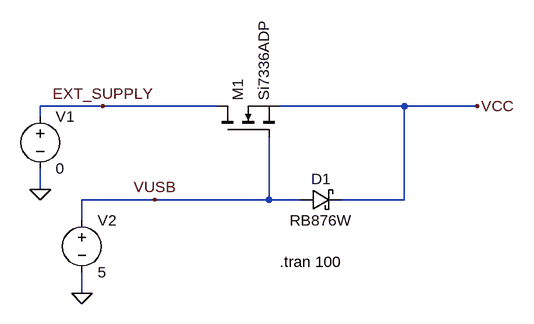
[diagram p0: schematic power_supply_selection.asc]
power_supply_selection.asc, the LTspice schematic file:
Version 4
SHEET 1 880 680
WIRE 64 288 -32 288
WIRE 240 288 64 288
WIRE 528 288 336 288
WIRE 640 288 528 288
WIRE -32 304 -32 288
WIRE -32 416 -32 384
WIRE 144 432 32 432
WIRE 320 432 320 336
WIRE 320 432 144 432
WIRE 368 432 320 432
WIRE 528 432 528 288
WIRE 528 432 432 432
WIRE 32 464 32 432
WIRE 32 576 32 544
FLAG 640 288 VCC
FLAG -32 416 0
FLAG 32 576 0
FLAG 64 288 EXT_SUPPLY
FLAG 144 432 VUSB
SYMBOL nmos 240 336 R270
SYMATTR InstName M1
SYMATTR Value Si7336ADP
SYMBOL schottky 368 448 R270
WINDOW 0 32 32 VTop 2
WINDOW 3 0 32 VBottom 2
SYMATTR InstName D1
SYMATTR Value RB876W
SYMBOL voltage -32 288 R0
WINDOW 123 0 0 Left 0
WINDOW 39 0 0 Left 0
SYMATTR InstName V1
SYMATTR Value 0
SYMBOL voltage 32 448 R0
WINDOW 123 0 0 Left 0
WINDOW 39 0 0 Left 0
SYMATTR InstName V2
SYMATTR Value 5
TEXT 336 528 Left 2 !.tran 100

The netlist it stands for:
* power_supply_selection.asc
M1 EXT_SUPPLY VUSB VCC VCC Si7336ADP
D1 VUSB VCC RB876W
V1 EXT_SUPPLY 0 0
V2 VUSB 0 5
.model D D
.lib standard.dio
.model NMOS NMOS
.model PMOS PMOS
.lib standard.mos
.tran 100
.backanno
.end